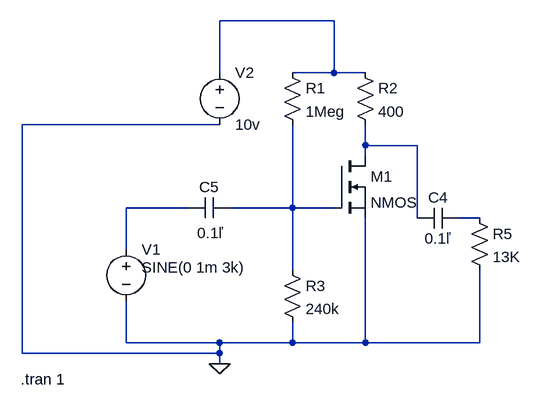
[diagram p0: schematic NNM24EE015_AnanyaC.asc]
NNM24EE015_AnanyaC.asc, the LTspice schematic file:
Version 4
SHEET 1 880 680
WIRE 144 -80 -32 -80
WIRE -32 0 -32 -80
WIRE 144 0 144 -80
WIRE 144 0 80 0
WIRE 192 0 144 0
WIRE -32 80 -336 80
WIRE 192 112 192 80
WIRE 272 112 192 112
WIRE 192 128 192 112
WIRE -80 208 -176 208
WIRE 80 208 80 80
WIRE 80 208 -16 208
WIRE 144 208 80 208
WIRE 272 224 272 112
WIRE 368 224 336 224
WIRE -176 272 -176 208
WIRE 80 304 80 208
WIRE -176 416 -176 352
WIRE -32 416 -176 416
WIRE 80 416 80 384
WIRE 80 416 -32 416
WIRE 192 416 192 224
WIRE 192 416 80 416
WIRE 368 416 368 304
WIRE 368 416 192 416
WIRE -336 432 -336 80
WIRE -32 432 -32 416
WIRE -32 432 -336 432
WIRE -32 448 -32 432
FLAG -32 448 0
SYMBOL nmos 144 128 R0
SYMATTR InstName M1
SYMBOL res 64 -16 R0
SYMATTR InstName R1
SYMATTR Value 1Meg
SYMBOL res 176 -16 R0
SYMATTR InstName R2
SYMATTR Value 400
SYMBOL res 64 288 R0
SYMATTR InstName R3
SYMATTR Value 240k
SYMBOL res 352 208 R0
SYMATTR InstName R5
SYMATTR Value 13K
SYMBOL cap 336 208 R90
WINDOW 0 0 32 VBottom 2
WINDOW 3 32 32 VTop 2
SYMATTR InstName C4
SYMATTR Value 0.1ľ
SYMBOL cap -16 192 R90
WINDOW 0 0 32 VBottom 2
WINDOW 3 39 30 VTop 2
SYMATTR InstName C5
SYMATTR Value 0.1ľ
SYMBOL voltage -176 256 R0
WINDOW 123 24 124 Left 2
WINDOW 39 0 0 Left 0
WINDOW 3 24 44 Left 2
SYMATTR InstName V1
SYMATTR Value SINE(0 1m 3k)
SYMBOL voltage -32 -16 R0
SYMATTR InstName V2
SYMATTR Value 10v
TEXT -338 472 Left 2 !.tran 1

The netlist it stands for:
* NNM24EE015_AnanyaC.asc
M1 N002 N004 0 0 NMOS
R1 N001 N004 1Meg
R2 N001 N002 400
R3 N004 0 240k
R5 N005 0 13K
C4 N005 N002 0.1ľ
C5 N004 N003 0.1ľ
V1 N003 0 SINE(0 1m 3k)
V2 N001 0 10v
.model NMOS NMOS
.model PMOS PMOS
.lib standard.mos
.tran 1
.backanno
.end